# EAGLE design hoekdrive17 (EAGLE 5.12)
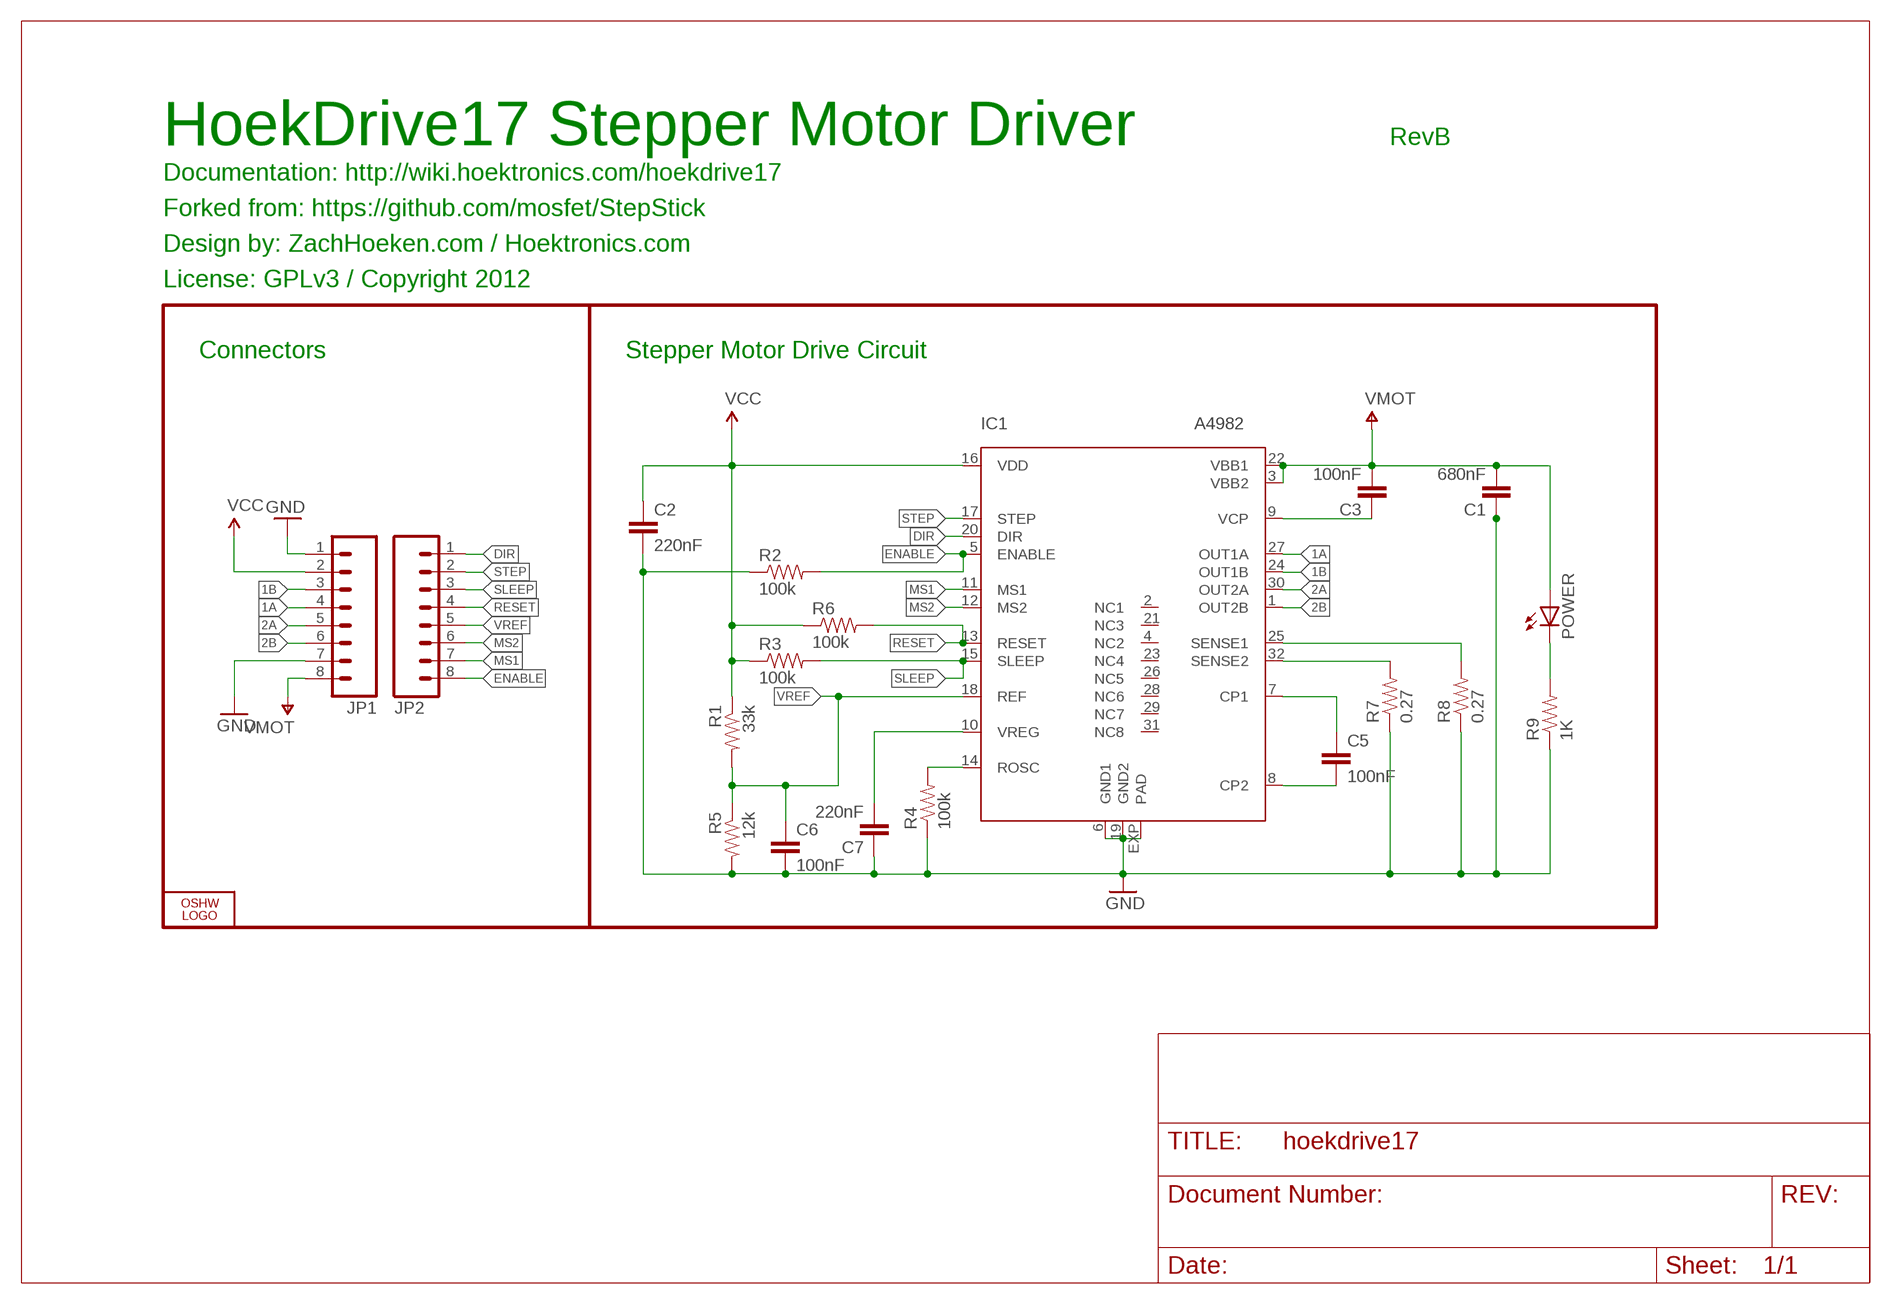
[diagram p0: schematic, sheet 1]

## Parts
C1  680nF  CAPACITOR0805  [0805-RC]
C2  220nF  CAPACITOR0603  [0603-RC]
C3  100nF  CAPACITOR0603  [0603-RC]
C5  100nF  CAPACITOR0603  [0603-RC]
C6  100nF  CAPACITOR0603  [0603-RC]
C7  220nF  CAPACITOR0603  [0603-RC]
IC1  A4982  [QFN32ET]
JP1  M08  [1X08]
JP2  M08  [1X08]
LOGO1  OSHW_LOGO_8MILX0100-NT  [OSHW_8X100_NOTEXT]
POWER  LED0603  [0603-LED]
R1  33k  RESISTOR0603  [0603-RC]
R2  100k  RESISTOR0603  [0603-RC]
R3  100k  RESISTOR0603  [0603-RC]
R4  100k  RESISTOR0603  [0603-RC]
R5  12k  RESISTOR0603  [0603-RC]
R6  100k  RESISTOR0603  [0603-RC]
R7  0.27  RESISTOR0805  [0805-RC]
R8  0.27  RESISTOR0805  [0805-RC]
R9  1K  RESISTOR0603  [0603-RC]

## Nets
1A: IC1.27(OUT1A) JP1.4
1B: IC1.24(OUT1B) JP1.3
2A: IC1.30(OUT2A) JP1.5
2B: IC1.1(OUT2B) JP1.6
C4: C5.1 IC1.7(CP1)
DIR: IC1.20(DIR) JP2.1
ENABLE: IC1.5(ENABLE) JP2.8 R2.2
GND: C1.1 C2.2 C6.2 C7.1 IC1.6(GND1) IC1.19(GND2) IC1.EXP(PAD) JP1.1 JP1.7 R2.1 R4.1 R5.2 R7.1 R8.1 R9.1
MS1: IC1.11(MS1) JP2.7
MS2: IC1.12(MS2) JP2.6
N$1: C3.1 IC1.9(VCP)
N$2: IC1.25(SENSE1) R8.2
N$3: IC1.32(SENSE2) R7.2
N$4: POWER.C R9.2
N$5: C5.2 IC1.8(CP2)
N$6: IC1.14(ROSC) R4.2
N$7: C7.2 IC1.10(VREG)
RESET: IC1.13(RESET) JP2.4 R6.2
SLEEP: IC1.15(SLEEP) JP2.3 R3.2
STEP: IC1.17(STEP) JP2.2
VCC: C2.1 IC1.16(VDD) JP1.2 R1.1 R3.1 R6.1
VMOT: C1.2 C3.2 IC1.3(VBB2) IC1.22(VBB1) JP1.8 POWER.A
VREF: C6.1 IC1.18(REF) JP2.5 R1.2 R5.1
Unconnected: IC1.2(NC1) IC1.4(NC2) IC1.21(NC3) IC1.23(NC4) IC1.26(NC5) IC1.28(NC6) IC1.29(NC7) IC1.31(NC8)

## Notes on the sheet
- HoekDrive17 Stepper Motor Driver | RevB
- Documentation: http://wiki.hoektronics.com/hoekdrive17
- Forked from: https://github.com/mosfet/StepStick
- Design by: ZachHoeken.com / Hoektronics.com
- License: GPLv3 / Copyright 2012
- Connectors | Stepper Motor Drive Circuit

## Library data of the parts
C1-C3 C5-C7 = Hoektronics:CAPACITOR: Capacitor Standard 0603 ceramic capacitor, and 0.1" leaded capacitor.
IC1 = Hoektronics:A4982: DMOS Microstepping Driver with Translator Auto generated by make-symbol-device-package-bsdl.ulp Rev. 32 Source: http://www.allegromicro.com/en/Products/Part_Numbers/4982/4982.pdf
JP1 JP2 = SparkFun:M08: Header 8 Standard 8-pin 0.1" header. Use with straight break away headers (SKU : PRT-00116), right angle break away headers (PRT-00553), swiss pins (PRT-00743), machine pins (PRT-00117), and female headers (PRT-00115).
LOGO1 = ohw-logo:OSHW_LOGO_8MIL
POWER = Hoektronics:LED: LEDs Standard schematic elements and footprints for 5mm, 3mm, 1206, and 0603 sized LEDs. 5mm - Spark Fun Electronics SKU : COM-00529 (and others)
R1-R9 = Hoektronics:RESISTOR: Resistor Basic schematic elements and footprints for 0603, 1206, and PTH 1/10th watt (small) resistors.

## Net classes
0 default: width 0.254 mm, clearance 0.178 mm

## Board
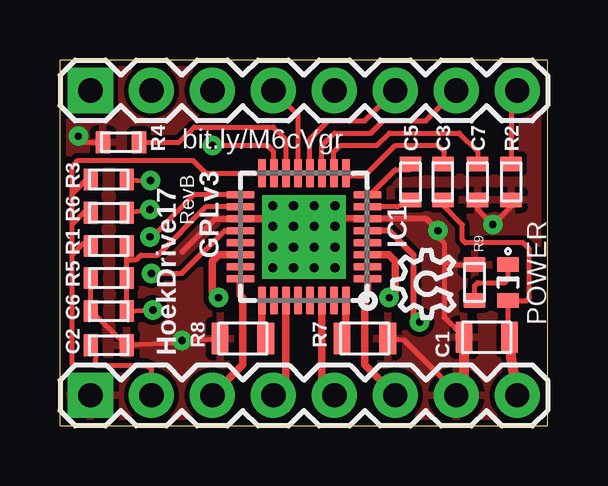
[diagram p1: board, top side]
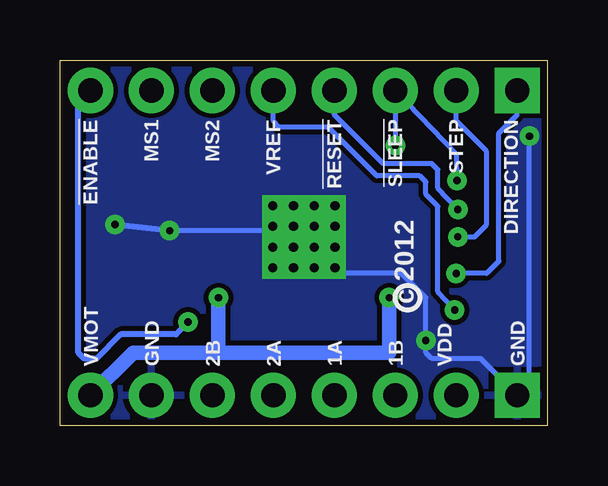
[diagram p2: board, bottom side, seen from below]

Size 20.32 x 15.24 mm. Coordinates in mm from the lower left corner, seen from the top.
Outline: 20.32,0 20.32,15.24 0,15.24 0,0 20.32,0
Copper layers (1*16): Top 0.035mm / dielectric 1.5mm / Bottom 0.035mm
Design rules "hoektronics *": minimum track width 8mil, minimum drill 20mil, track to track 8mil, track to pad 8mil, pad to pad 8mil, via to via 8mil, smd to smd 8mil, copper to edge 10mil, drill to drill 8mil, minimum pad ring 12mil, minimum via ring 10mil, stop-mask expansion 4mil, vias tented up to drill 25mil, thermal gap 10mil
tRestrict: area 9.8,9.5 to 10.5,9.8; area 11.8,7.5 to 12.1,8.3; area 9.8,6 to 10.5,6.2; area 8.3,7.5 to 8.5,8.3; area 0.9,4.2 to 1.8,6.7

### Footprints (pad centres in the part's own frame; a part is rotated, then mirrored left to right if it is on the bottom)
0805-RC = smd 0.7 x 1.3: 1 -0.95,0; 2 0.95,0
0603-RC = smd 0.6 x 0.9: 1 -0.75,0; 2 0.75,0
QFN32ET = smd 1.15 x 0.3: 1 -2.4,1.5; 2 -2.4,1; 3 -2.4,0.5; 4 -2.4,0; 5 -2.4,-0.5; 6 -2.4,-1; 7 -2.4,-1.5; 8 -2.4,-2; 17 2.9,-2; 18 2.9,-1.5; 19 2.9,-1; 20 2.9,-0.5; 21 2.9,0; 22 2.9,0.5; 23 2.9,1; 24 2.9,1.5 | smd 0.3 x 1.15: 9 -1.5,-2.9; 10 -1,-2.9; 11 -0.5,-2.9; 12 0,-2.9; 13 0.5,-2.9; 14 1,-2.9; 15 1.5,-2.9; 16 2,-2.9; 25 2,2.4; 26 1.5,2.4; 27 1,2.4; 28 0.5,2.4; 29 0,2.4; 30 -0.5,2.4; 31 -1,2.4; 32 -1.5,2.4 | smd 3.4 x 3.4: EXP 0.25,-0.25
1X08 = drill 1.016 pad 1.88 square: 1 0,0 | drill 1.016 pad 1.88 round: 2 2.54,0; 3 5.08,0; 4 7.62,0; 5 10.16,0; 6 12.7,0; 7 15.24,0; 8 17.78,0
0603-LED = smd 0.6 x 0.9: A 0.75,0; C -0.75,0

### Placement (x,y rotation side)
C1  17.78,3.68 0 top
C2  2.03,3.35 0 top
C3  15.95,10.16 270 top
C5  14.61,10.16 90 top
C6  2.03,4.78 180 top
C7  17.4,10.16 90 top
IC1  10.41,7.62 180 top
JP1  1.27,1.27 0 top
JP2  1.27,13.97 0 top
LOGO1  16.41,4.5 90 top
POWER  18.67,5.97 270 top
R1  2.03,7.49 0 top
R2  18.8,10.16 90 top
R3  2.03,10.26 0 top
R4  2.54,11.81 0 top
R5  2.03,6.16 180 top
R6  2.03,8.88 0 top
R7  12.7,3.63 180 top
R8  7.62,3.63 0 top
R9  17.27,5.97 270 top

### Tracks (layer width: path | path; a pad name or v marks a point on that pad's centre or on a via)
1A
  Top 0.305: IC1.27 9.41,1.79 JP1.4
1B
  Top 0.305: IC1.24 7.51,5.44 7.62,5.33 7.62,2.54 JP1.3
2A
  Top 0.305: IC1.30 10.91,1.79 JP1.5
2B
  Top 0.305: IC1.1 12.81,5.45 12.7,5.33 12.7,2.54 JP1.6
C4
  Top 0.203: IC1.7 14.06,9.12 C5.1
DIR  (via drill 0.3)
  Top 0.203: v3.81,6.35 5.08,6.35 6.86,8.13 IC1.20
  Bottom 0.203: JP2.1 1.27,12.95 2.03,12.19 2.03,6.86 2.54,6.35 v3.81,6.35
ENABLE  (via drill 0.3)
  Top 0.203: R2.2 18.8,13.72 JP2.8
  Top 0.254: IC1.5 13.72,8.12 14.73,7.11 14.73,4.57 v14.99,4.32
  Bottom 0.254: JP2.8 19.56,13.46 19.56,3.05 19.3,2.79 18.8,2.79 17.78,3.81 15.49,3.81 v14.99,4.32
GND  (via drill 0.3, 0.38)
  Top 0.203: R5.2 C6.2 2.68,3.43 C2.2 4.95,3.43 v5.08,3.56 R8.1 | JP1.7 16.51,1.4 14.35,3.56 R7.1 | R4.1 1.02,11.81 v0.76,12.06 | 5.08,7.24 6.46,8.62 | 8.55,8.62 v8.87,8.31 | v15.75,8.13 15.75,7.87 16,7.62 16,6.99 | 16,6.99 16,4.51 C1.1 | C7.1 17.4,9.02 v18.03,8.38 18.8,9.14 R2.1 | R9.1 16.27,6.72 16,6.99
  Top 0.254: v15.75,8.13 15.26,8.62 IC1.6 12.8,8.64 11.68,8.64 11.43,8.89 v11.46,9.17 | v10.59,9.17 v10.59,8.31 | 6.46,8.62 IC1.19
  Top 0.305: v10.59,9.17 v9.73,9.17 v8.87,9.17 v8.87,8.31 | v11.46,8.31 v10.59,8.31 10.41,8.62 10.16,8.62 IC1.EXP 10.16,7.62 v10.59,7.44 v11.46,7.44 | IC1.19 8.55,8.62
  Top 0.406: C1.1 16.83,1.59 JP1.7
  Bottom 0.203: v0.76,12.06 0.76,1.78 JP1.1 2.79,2.79 4.83,2.79 5.08,3.05 5.08,3.3 | 5.08,3.3 4.83,3.56 | 5.08,3.3 v5.08,3.56 5.08,5.33 6.1,6.35 8.64,6.35 | v15.75,8.13 11.46,8.13 v11.46,8.31
  Bottom 0.254: v15.75,8.13 v18.03,8.38
  Bottom 0.305: v10.59,8.31 v9.73,8.31 9.4,7.87 9.4,7.62 9.14,7.62 v8.87,7.44 | v8.87,6.58 v9.73,6.58 v10.59,6.58 v11.46,6.58 v11.46,7.44
  other vias: 9.73,7.44
  pour Bottom: -1.27,-1.27 21.59,-1.27 21.59,16.51 -1.27,16.51
  pour Top: -1.27,16.51 21.59,16.51 21.59,-1.27 -1.27,-1.27
MS1
  Top 0.203: IC1.11 10.91,11.68 11.43,12.19 12.95,12.19 13.46,12.7 15.24,12.7 JP2.7
MS2
  Top 0.203: IC1.12 10.41,11.94 11.18,12.7 12.7,12.7 JP2.6
N$1
  Top 0.203: C3.1 16,11.43 15.75,11.68 13.97,11.68 12.7,10.41 12.02,10.41 IC1.9
N$2
  Top 0.305: IC1.25 8.41,3.66 R8.2
N$3
  Top 0.305: IC1.32 11.91,3.67 R7.2
N$4
  Top 0.203: R9.2 17.27,5.84 17.4,5.97 18.54,5.97 18.67,6.1 POWER.C
N$5
  Top 0.203: IC1.8 12.92,9.62 13.97,10.67 14.6,10.67 C5.2
N$6
  Top 0.203: R4.2 4.95,11.81 5.59,12.45 8.89,12.45 9.4,11.94 9.4,10.54 IC1.14
N$7
  Top 0.203: IC1.10 11.41,11.41 11.68,11.68 13.21,11.68 13.72,12.19 16.64,12.19 17.4,11.43 C7.2
RESET  (via drill 0.3)
  Top 0.203: IC1.13 9.91,12.95 JP2.4 | R6.2 v3.75,9.02
  Bottom 0.203: JP2.4 9.27,13.59 8.89,13.21 8.89,12.95 6.86,10.92 4.83,10.92 4.57,10.67 4.57,9.91 v3.75,9.02
SLEEP  (via drill 0.3)
  Top 0.203: v6.35,11.68 8.64,11.68 8.89,11.43 8.89,10.54 IC1.15 | R3.2 3.58,10.19 v3.77,10.22
  Bottom 0.203: v6.35,11.68 JP2.3 3.8,11.3 v3.77,10.22
STEP  (via drill 0.3)
  Top 0.203: v3.75,7.87 3.87,7.87 5.59,9.65 7.48,9.65 IC1.17
  Bottom 0.203: JP2.2 3.81,12.7 2.54,11.43 2.54,8.38 3.05,7.87 v3.75,7.87
VCC
  Top 0.203: R1.1 1.02,7.62 0.51,7.11 | 0.51,9.65 1.27,10.41 R3.1 | 0.51,7.11 0.51,8.38 | 0.51,8.38 0.51,9.65 | 0.51,8.38 1.14,9.02 R6.1 | 0.51,9.65 0.51,10.79 0.74,11.05 5.54,11.05 6.08,10.52 IC1.16 | 0.51,7.11 0.51,2.52 1.47,2.52 | 1.47,2.52 3.56,2.52 3.81,2.41 JP1.2 | C2.1 1.51,2.94 1.47,2.52
VMOT  (via drill 0.3)
  Top 0.203: C3.2 16,9.14 16.76,8.38 16.76,7.75 16.89,7.62 19.3,7.62 19.56,7.37 19.56,5.33 19.43,5.21 18.81,5.21 POWER.A 18.67,4.13 C1.2
  Top 0.305: IC1.22 6.61,7.12 6.35,6.86 6.35,5.59 v6.6,5.33 | IC1.3 13.71,7.12 13.97,6.86 13.97,5.59 v13.72,5.33
  Top 0.406: JP1.8 18.8,2.85 C1.2
  Bottom 0.61: JP1.8 17.27,3.05 13.97,3.05 | 13.97,3.05 6.6,3.05 v6.6,5.33 | v13.72,5.33 13.72,3.3 13.97,3.05
VREF  (via drill 0.3)
  Top 0.203: 2.79,6.92 R5.1 C6.1 v3.87,4.83 | 2.79,6.92 R1.2 | IC1.18 7.49,9.14 6.1,9.14 4.06,7.11 3.37,7.11 3.17,6.92 2.79,6.92
  Bottom 0.203: JP2.5 11.43,12.7 11.18,12.45 9.14,12.45 7.11,10.41 5.33,10.41 5.08,10.16 5.08,9.65 4.57,9.14 4.57,5.59 v3.87,4.83

### Text on the board
tPlace: bit.ly/M6cVgr | RevB | GPLv3 | HoekDrive17
bPlace: DIRECTION | STEP | !SLEEP | !RESET | VREF | MS2 | MS1 | !ENABLE | c 2012 | GND | VDD | 1B | 1A | 2A | 2B | GND | VMOT